# EAGLE design v2_phys (EAGLE 9.6.2)
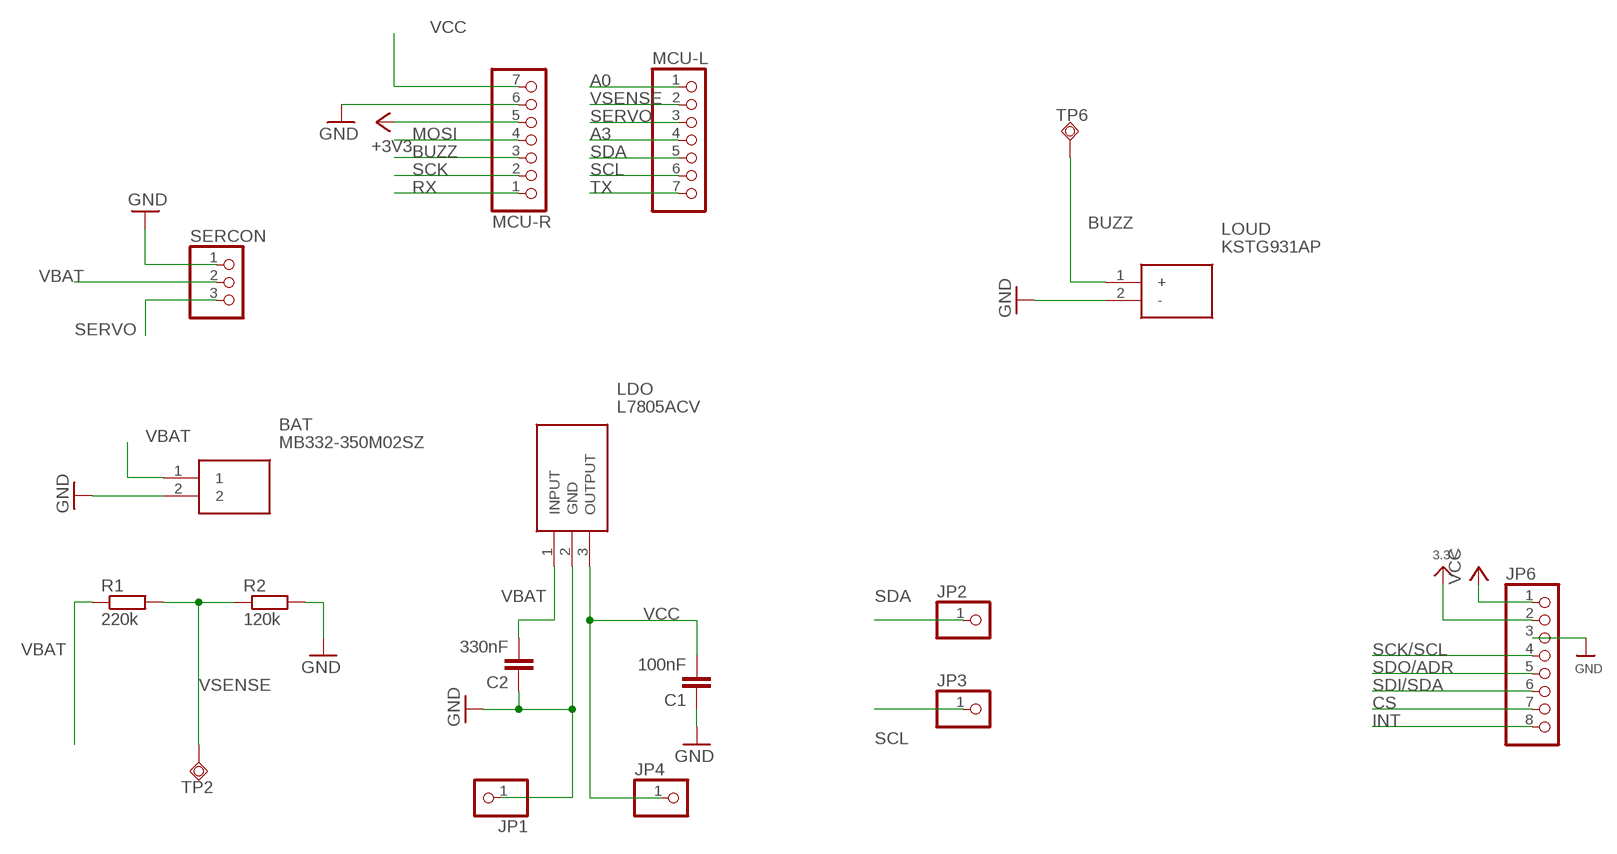
[diagram p0: schematic, sheet 1]

## Parts
BAT  MB332-350M02SZ  [MB332350M02SZ]
C1  100nF  C-EU025-024X044  [C025-024X044]
C2  330nF  C-EU025-024X044  [C025-024X044]
JP1  PINHD-1X1  [1X01]
JP2  PINHD-1X1  [1X01]
JP3  PINHD-1X1  [1X01]
JP4  PINHD-1X1  [1X01]
JP6  HEADER-1X870MIL  [1X08_ROUND_70]
LDO  L7805ACV  [TO255P460X1020X2008-3P]
LOUD  KSTG931AP  [CAPPRD400W70D900H500]
MCU-L  HEADER-1X7  [1X07_OVAL]
MCU-R  HEADER-1X7  [1X07_OVAL]
R1  220k  R-EU_0204/2V  [0204V]
R2  120k  R-EU_0204/2V  [0204V]
SERCON  PINHD-1X3  [1X03]
TP2  TPSQB2,54  [B2,54]
TP6  TPSQB2,54  [B2,54]

## Nets
3.3V: JP6.2
+3V3: MCU-R.5
A0: MCU-L.1
A3: MCU-L.4
BUZZ: LOUD.1(+) MCU-R.3 TP6.TP
CS: JP6.7
GND [highpower]: BAT.2 C1.1 C2.1 JP1.1 JP6.3 LDO.2(GND) LOUD.2(-) MCU-R.6 R2.2 SERCON.1
INT: JP6.8
MOSI: MCU-R.4
RX: MCU-R.1
SCK: MCU-R.2
SCK/SCL: JP6.4
SCL: JP3.1 MCU-L.6
SDA: JP2.1 MCU-L.5
SDI/SDA: JP6.6
SDO/ADR: JP6.5
SERVO: MCU-L.3 SERCON.3
TX: MCU-L.7
VBAT: BAT.1 C2.2 LDO.1(INPUT) R1.1 SERCON.2
VCC [highpower]: C1.2 JP4.1 JP6.1 LDO.3(OUTPUT) MCU-R.7
VSENSE: MCU-L.2 R1.2 R2.1 TP2.TP

## Library data of the parts
BAT = SamacSys_Parts:MB332-350M02SZ: RS PRO 3.5mm Pitch Straight, PCB Terminal Block, Through Hole, 2 Way Source: Datasheet; DESCRIPTION: RS PRO 3.5mm Pitch Straight, PCB Terminal Block, Through Hole, 2 Way; HEIGHT: 12.76mm; MANUFACTURER_NAME: RS Components; MANUFACTURER_PART_NUMBER: MB332-350M02SZ; RS_PART_NUMBER: 7901149; RS_PRICE-STOCK: https://uk.rs-online.com/web/p/products/7901149
C1 C2 = rcl:C-EU: CAPACITOR, European symbol; SPICEPREFIX: C
JP1-JP4 = pinhead:PINHD-1X1: PIN HEADER
JP6 = microbuilder:HEADER-1X8: PIN HEADER
LDO = SamacSys_Parts:L7805ACV: Linear voltage regulator,L7805ACV 5V 1A STMicroelectronics L7805ACV, Single Linear Voltage Regulator, 1A 5 V, 2%, 3-Pin TO-220 Source: Datasheet <http://uk.rs-online.com/web/p/products/2988508P>; ALLIED_NUMBER: 70013701; DESCRIPTION: Linear voltage regulator,L7805ACV 5V 1A STMicroelectronics L7805ACV, Single Linear Voltage Regulator, 1A 5 V, 2%, 3-Pin TO-220; HEIGHT: 4.6mm; MANUFACTURER_NAME: STMicroelectronics; MANUFACTURER_PART_NUMBER: L7805ACV; RS_PART_NUMBER: 2988508P; RS_PRICE-STOCK: http://uk.rs-online.com/web/p/products/2988508P
LOUD = SamacSys_Parts:KSTG931AP: RS PRO 4V Electromagnetic Buzzer, 92dB Source: Datasheet; DESCRIPTION: RS PRO 4V Electromagnetic Buzzer, 92dB; HEIGHT: 5mm; MANUFACTURER_NAME: RS Components; MANUFACTURER_PART_NUMBER: KSTG931AP
MCU-L MCU-R = microbuilder:HEADER-1X7: PIN HEADER
R1 R2 = rcl:R-EU_: RESISTOR, European symbol; SPICEPREFIX: R
SERCON = pinhead:PINHD-1X3: PIN HEADER
TP2 TP6 = testpad:TPSQ: Test pad

## Net classes
1 highpower: width 0.305 mm, drill 0.483 mm
2 lowpower: width 0.305 mm, drill 0.483 mm

## Board
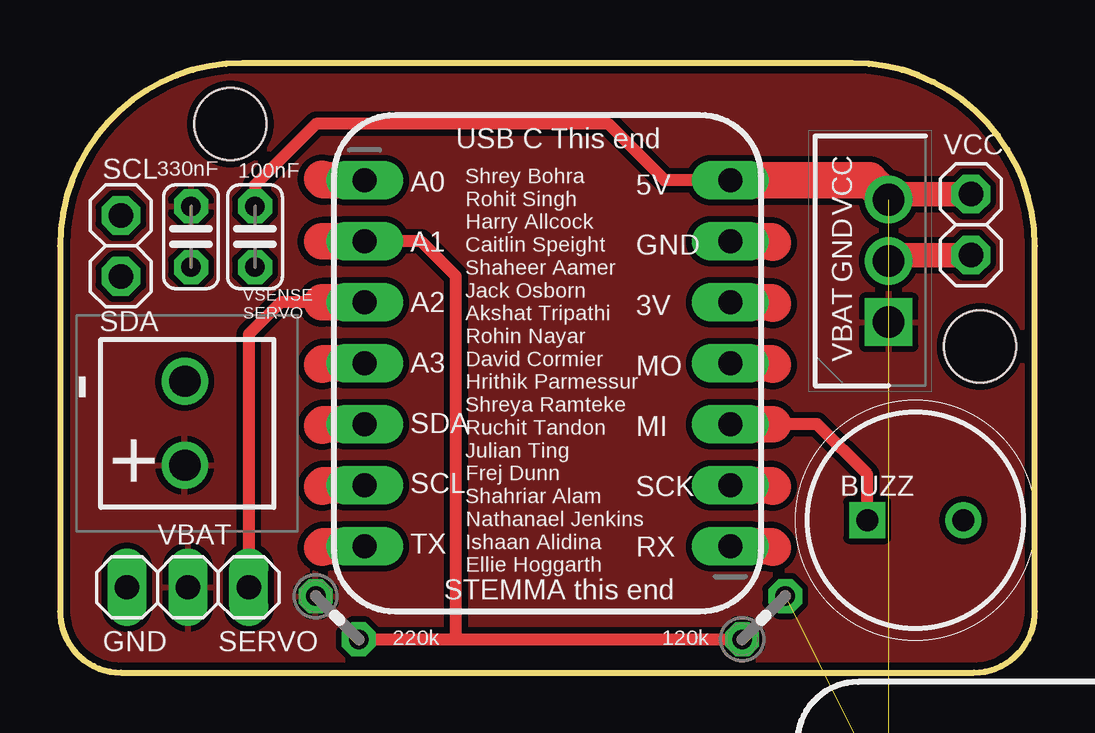
[diagram p1: board, top side]
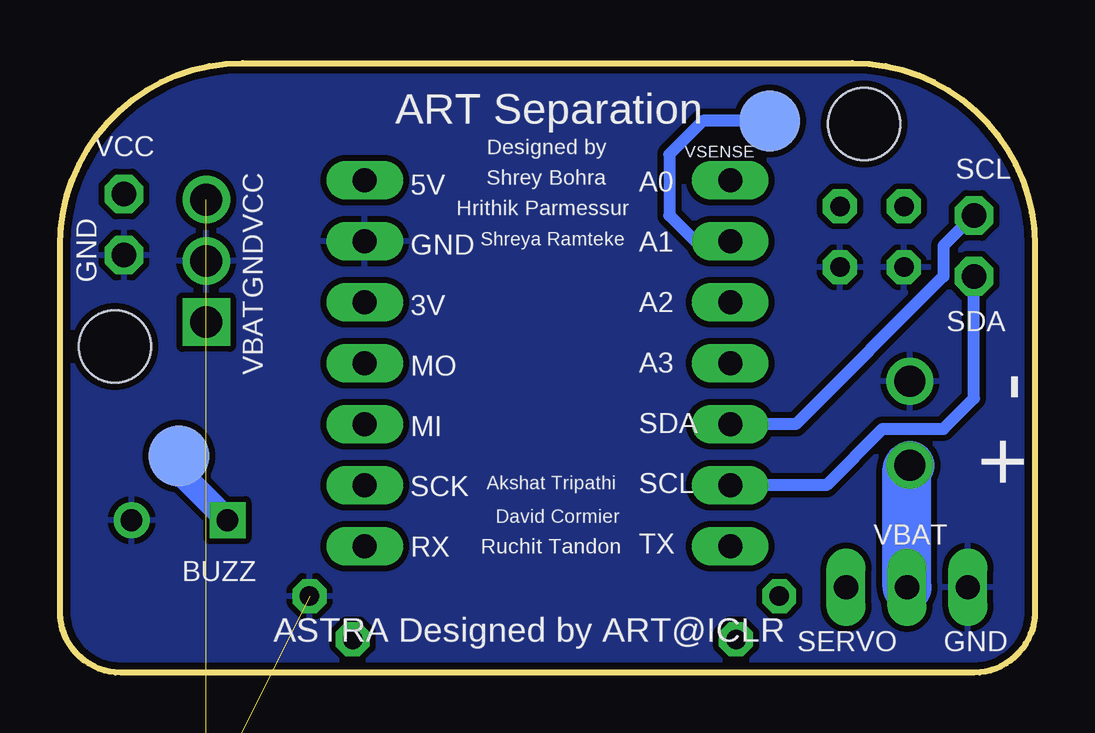
[diagram p2: board, bottom side, seen from below]

Size 40.64 x 25.4 mm. Coordinates in mm from the lower left corner, seen from the top.
Outline: 7.62,25.4 arc90 0,17.78 0,2.54 arc90 2.54,0 38.1,0 arc90 40.64,2.54 40.64,17.78 arc90 33.02,25.4 7.62,25.4
Copper layers (1*16): Top 0.035mm / dielectric 1.5mm / Bottom 0.035mm
Design rules "aisler_2_layer_simple *": minimum track width 0.1mm, minimum drill 0.3mm, track to track 0.1mm, track to pad 0.1mm, pad to pad 0.1mm, via to via 0.1mm, smd to smd 0.1mm, copper to edge 0.3mm, drill to drill 0.25mm, minimum pad ring 0.3mm, minimum via ring 0.2mm, stop-mask expansion 0mil, vias tented up to drill 0mil, thermal gap 10mil
Holes 3 mm at 7.11,22.86 38.35,13.59

### Footprints (pad centres in the part's own frame; a part is rotated, then mirrored left to right if it is on the bottom)
MB332350M02SZ = drill 1.3 pad 1.95: 1 0,0; 2 3.5,0
C025-024X044 = drill 0.813 octagon: 1 -1.27,0; 2 1.27,0
1X01 = drill 1.016 octagon: 1 0,0
1X08_ROUND_70 = drill 1 pad 1.778: 1 -8.89,0; 2 -6.35,0; 3 -3.81,0; 4 -1.27,0; 5 1.27,0; 6 3.81,0; 7 6.35,0; 8 8.89,0
TO255P460X1020X2008-3P = drill 1.32 pad 1.98 square: 1 0,0 | drill 1.32 pad 1.98: 2 2.55,0; 3 5.1,0
CAPPRD400W70D900H500 = drill 0.9 pad 1.35 square: 1 0,0 | drill 0.9 pad 1.35: 2 4,0
1X07_OVAL = drill 1 long: 1 -7.62,0; 2 -5.08,0; 3 -2.54,0; 4 0,0; 5 2.54,0; 6 5.08,0; 7 7.62,0
0204V = drill 0.813 octagon: 1 -1.27,0; 2 1.27,0
1X03 = drill 1.016 long: 1 -2.54,0; 2 0,0; 3 2.54,0
B2,54 = smd 2.54 x 2.54: TP 0,0

### Placement (x,y rotation side)
BAT  5.21,8.64 90 top
C1  8.13,18.16 90 top
C2  5.46,18.16 90 top
JP1  37.97,17.4 0 top
JP2  2.54,19.05 0 top
JP3  2.54,16.51 0 top
JP4  37.97,19.94 0 top
JP6  43.43,-15.62 0 top  (outside the outline)
LDO  34.54,14.61 90 top
LOUD  33.66,6.35 0 top
MCU-L  12.7,12.89 270 top
MCU-R  27.94,12.89 90 top
R1  11.56,2.29 315 top
R2  29.34,2.29 45 top
SERCON  5.33,3.56 0 top
TP2  11.05,22.99 0 bottom
TP6  35.69,9.02 0 bottom

### Tracks (layer width: path | path; a pad name or v marks a point on that pad's centre or on a via)
+3V3
  Top 1.524: MCU-R.5 29.66,15.43 29.72,15.37
A0
  Top 1.524: MCU-L.1 10.98,20.51 10.92,20.57
A3
  Top 1.524: MCU-L.4 10.98,12.89 10.92,12.83
BUZZ
  Top 0.508: LOUD.1 33.66,8.25 31.56,10.35 29.72,10.35
  Top 1.524: MCU-R.3 29.72,10.35
  Bottom 0.254: TP6.TP 35.69,8.89
  Bottom 1.016: LOUD.1 35.69,8.38 35.69,8.89
GND  (1 unrouted)
  Top 1.016: JP1.1 34.79,17.4 LDO.2
  Top 1.524: MCU-R.6 29.66,17.97 29.72,17.91
  pour Bottom (isolate 0.254): -2.54,-2.54 40.64,-2.54 43.18,0 43.18,25.4 40.64,27.94 0,27.94 -3.81,24.13 -3.81,-1.27
MOSI
  Top 1.524: MCU-R.4 29.66,12.89 29.72,12.83
RX
  Top 1.524: MCU-R.1 29.66,5.27 29.72,5.21
SCK
  Top 1.524: MCU-R.2 29.66,7.81 29.72,7.75
SCL
  Top 1.524: MCU-L.6 10.98,7.81 10.92,7.75
  Bottom 0.508: MCU-L.6 8.7,7.81 6.35,10.16 3.81,10.16 2.54,11.43 JP3.1
SDA
  Top 1.524: MCU-L.5 10.98,10.35 10.92,10.29
  Bottom 0.508: JP2.1 3.81,17.78 3.81,16.51 9.97,10.35 MCU-L.5
SERVO
  Top 0.508: 10.92,15.43 9.21,15.43 7.87,14.1 SERCON.3
  Top 1.524: MCU-L.3 10.92,15.43
TX
  Top 1.524: MCU-L.7 10.98,5.27 10.92,5.21
VBAT
  Bottom 2.032: SERCON.2 5.33,8.51 BAT.1
  pour Top (isolate 0.254): -1.27,27.94 41.91,27.94 43.18,26.67 43.18,-2.54 -2.54,-2.54 -3.81,-1.27 -3.81,25.4
VCC  (1 unrouted)
  Top 0.508: 34.78,19.94 LDO.3 | MCU-R.7 25.21,20.51 22.86,22.86 10.67,22.86 8.13,20.32 C1.2
  Top 1.016: JP4.1 34.78,19.94
  Top 1.524: LDO.3 33.74,20.51 MCU-R.7
VSENSE
  Top 0.508: R1.2 16.51,1.39 | 16.51,1.39 R2.1 | 16.51,1.39 16.51,16.51 15.05,17.97 MCU-L.2
  Top 1.524: MCU-L.2 10.92,17.97
  Bottom 0.254: 13.97,17.78 12.89,17.78 MCU-L.2
  Bottom 0.508: TP2.TP 13.84,22.99 15.24,21.59 15.24,19.05 13.97,17.78

### Text on the board
tPlace: USB C This end | VCC | SCL | VCC | GND | VSENSE / SERVO | SDA | VBAT | - | + | BUZZ | VBAT | A0 / / A1 / / A2 / / A3 / / SDA / / SCL / / TX | 5V / / GND / / 3V / / MO / / MI / / SCK / / RX | Shrey Bohra / Rohit Singh / Harry Allcock / Caitlin Speight / Shaheer Aamer / Jack Osborn / Akshat Tripathi / Rohin Nayar / David Cormier / Hrithik Parmessur / Shreya Ramteke / Ruchit Tandon / Julian Ting / Frej Dunn / Shahriar Alam / Nathanael Jenkins / Ishaan Alidina / Ellie Hoggarth | STEMMA this end | GND | SERVO
bPlace: ART Separation | VCC | VSENSE | Designed by | VCC | SCL | Shrey Bohra | Hrithik Parmessur | Shreya Ramteke | GND | GND | VBAT | SDA | - | + | Akshat Tripathi | David Cormier | VBAT | A0 / / A1 / / A2 / / A3 / / SDA / / SCL / / TX | Ruchit Tandon | 5V / / GND / / 3V / / MO / / MI / / SCK / / RX | BUZZ | GND | SERVO | ASTRA Designed by ART@ICLR
bStop: +